# Altium schematic sheet Power_3.SchDoc
size A4; CompanyName: TH Nürnberg; Organization: UltraZohm; Address1: Kesslerplatz 12; Address2: 90489 Nürnberg; Address3: GERMANY; SheetNumber: 7; SheetTotal: 10
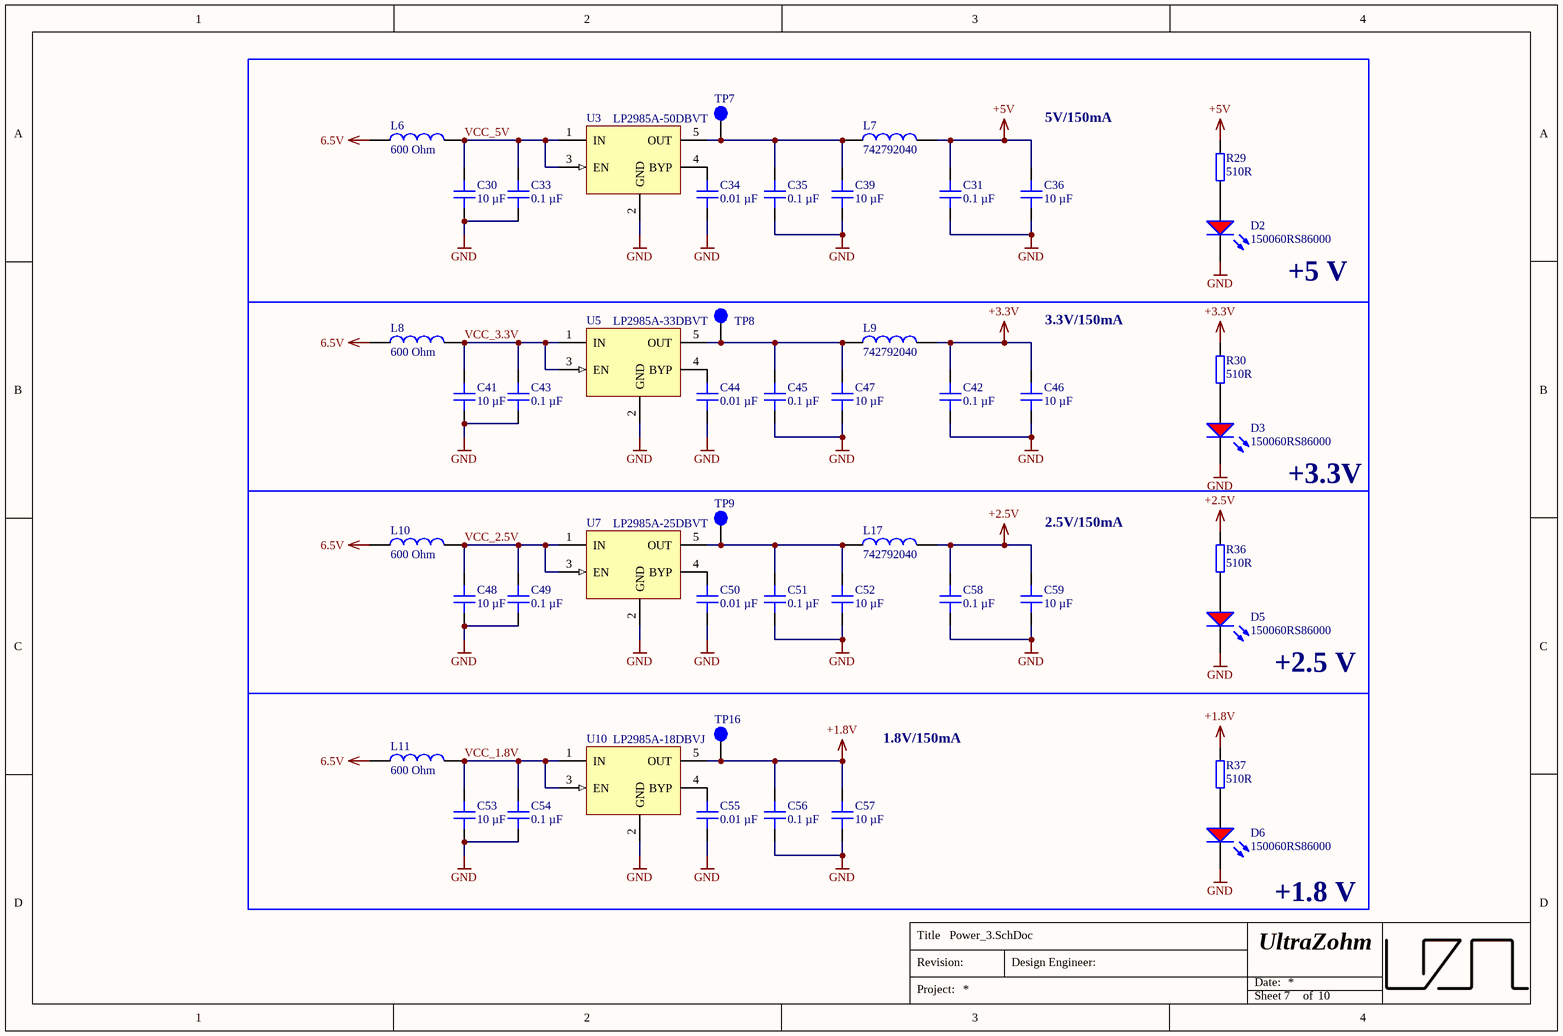
[diagram p0: Power_3.SchDoc]

## Parts
C30  10 µF  [C_1206]
C31  0.1 µF  [C_0603]
C33  0.1 µF  [C_0603]
C34  0.01 µF  [C_0603]
C35  0.1 µF  [C_0603]
C36  10 µF  [C_1206]
C39  10 µF  [C_1206]
C41  10 µF  [C_1206]
C42  0.1 µF  [C_0603]
C43  0.1 µF  [C_0603]
C44  0.01 µF  [C_0603]
C45  0.1 µF  [C_0603]
C46  10 µF  [C_1206]
C47  10 µF  [C_1206]
C48  10 µF  [C_1206]
C49  0.1 µF  [C_0603]
C50  0.01 µF  [C_0603]
C51  0.1 µF  [C_0603]
C52  10 µF  [C_1206]
C53  10 µF  [C_1206]
C54  0.1 µF  [C_0603]
C55  0.01 µF  [C_0603]
C56  0.1 µF  [C_0603]
C57  10 µF  [C_1206]
C58  0.1 µF  [C_0603]
C59  10 µF  [C_1206]
D2  150060RS86000  [WL-SMCW_0603]
D3  150060RS86000  [WL-SMCW_0603]
D5  150060RS86000  [WL-SMCW_0603]
D6  150060RS86000  [WL-SMCW_0603]
L6  600 Ohm  [WE-CBF_0805_High Current]
L7  742792040  [WE-CBF_0805_High Current]
L8  600 Ohm  [WE-CBF_0805_High Current]
L9  742792040  [WE-CBF_0805_High Current]
L10  600 Ohm  [WE-CBF_0805_High Current]
L11  600 Ohm  [WE-CBF_0805_High Current]
L17  742792040  [WE-CBF_0805_High Current]
R29  510R  [RES 0603_1608]
R30  510R  [RES 0603_1608]
R36  510R  [RES 0603_1608]
R37  510R  [RES 0603_1608]
TP7  -  [TP_1mm]  (value not drawn)
TP8  -  [TP_1mm]  (value not drawn)
TP9  -  [TP_1mm]  (value not drawn)
TP16  -  [TP_1mm]  (value not drawn)
U3  LP2985A-50DBVT  [SOT95P250X110-5N]
U5  LP2985A-33DBVT  [SOT95P250X110-5N]
U7  LP2985A-25DBVT  [SOT95P250X110-5N]
U10  LP2985A-18DBVJ  [SOT95P250X110-5N]

## Blocks framed on the sheet
+5 V: C30 C31 C33-C36 C39 D2 L6 L7 R29 TP7 U3

## Nets
6.5V: L6.1 L8.1 L10.1 L11.1
+1.8V: C56.2 C57.2 R37.2 TP16.1 U10.5(OUT)
+2.5V: C58.2 C59.2 L17.2 R36.2
+3.3V: C42.2 C46.2 L9.2 R30.2
+5V: C31.2 C36.2 L7.2 R29.2
GND: C30.1 C31.1 C33.1 C34.1 C35.1 C36.1 C39.1 C41.1 C42.1 C43.1 C44.1 C45.1 C46.1 C47.1 C48.1 C49.1 C50.1 C51.1 C52.1 C53.1 C54.1 C55.1 C56.1 C57.1 C58.1 C59.1 D2.1(K) D3.1(K) D5.1(K) D6.1(K) U3.2(GND) U5.2(GND) U7.2(GND) U10.2(GND)
VCC_1.8V: C53.2 C54.2 L11.2 U10.1(IN) U10.3(EN)
VCC_2.5V: C48.2 C49.2 L10.2 U7.1(IN) U7.3(EN)
VCC_3.3V: C41.2 C43.2 L8.2 U5.1(IN) U5.3(EN)
VCC_5V: C30.2 C33.2 L6.2 U3.1(IN) U3.3(EN)
NetC34_2: C34.2 U3.4(BYP)
NetC35_2: C35.2 C39.2 L7.1 TP7.1 U3.5(OUT)
NetC44_2: C44.2 U5.4(BYP)
NetC45_2: C45.2 C47.2 L9.1 TP8.1 U5.5(OUT)
NetC50_2: C50.2 U7.4(BYP)
NetC51_2: C51.2 C52.2 L17.1 TP9.1 U7.5(OUT)
NetC55_2: C55.2 U10.4(BYP)
NetD2_2: D2.2(A) R29.1
NetD3_2: D3.2(A) R30.1
NetD5_2: D5.2(A) R36.1
NetD6_2: D6.2(A) R37.1

## Notes on the sheet
- 5V/150mA
- 3.3V/150mA
- +3.3V
- 2.5V/150mA
- +2.5 V
- 1.8V/150mA
- +1.8 V
- Title
- Revision:
- Design Engineer:
- Date:
- Project:
- Sheet
- of

## Library data of the parts
C30 C36 C39 C41 C46-C48 C52 C53 C57 C59 = C1206C106J3RACAUTO: Capacitor 1206, 25 VDC, 10 µF, X7R; Manufacturer: KEMET; Tolerance: 5 %; Voltage Rating: 25 VDC; Created from: MGremer; Manufacturer Part Number: C1206C106J3RACAUTO; PartID: 24; Created On: 20.12.2020 13:54:13; ComponentLink1Description: Datasheet; ComponentLink1URL: https://www.mouser.de/datasheet/2/212/KEM_C1023_X7R_AUTO_SMD-1093309.pdf; Component Type: Capacitor 1206; Device Package: 1206; Last Updated: 20.12.2020 16:34:30; Mounting Type: SMD; Operating Temperature: -55 - 125°C; Series: SMD Auto X7R; Supplier 1: Mouser; Supplier Part Number 1: 80-C1206C106J3RAUTO; Type: Capacitor; Value: 10 µF; Live Cycle Status: 1; Stock number: Labor SMD Container
C31 C33 C35 C42 C43 C45 C49 C51 C54 C56 C58 = C0603X104K5RAC7411: Capacitor 0603, 50 VDC, 0.1 µF, X7R; Manufacturer: KEMET; Tolerance: 10 %; Voltage Rating: 50 VDC; Created from: MGremer; Manufacturer Part Number: C0603X104K5RAC7411; PartID: 3; Created On: 20.12.2020 13:54:13; ComponentLink1Description: Datasheet; ComponentLink1URL: https://www.mouser.de/datasheet/2/212/1/KEM_C1013_X7R_FT_CAP_SMD-1103280.pdf; Component Type: Capacitor 0603; Device Package: 0603; Last Updated: 04.03.2021 09:24:28; Mounting Type: SMD; Operating Temperature: -55 - 125°C; Series: SMD Comm X7R Flex; Supplier 1: Mouser; Supplier Part Number 1: 80-C0603X104K5R7411; Supplier 2: LCSC; Supplier Part Number 2: C14663; Type: Capacitor; Value: 0.1 µF; Live Cycle Status: 1; LCSC Part Number: C14663; Stock number: Labor SMD Container
C34 C44 C50 C55 = GCJ188R71H103KA01D: Capacitor 0603, 50 VDC, 0.01 µF, X7R; Manufacturer: muRata; Tolerance: 10 %; Voltage Rating: 50 VDC; Created from: MGremer; Manufacturer Part Number: GCJ188R71H103KA01D; PartID: 1; Created On: 20.12.2020 13:54:13; ComponentLink1Description: Datasheet; ComponentLink1URL: https://www.mouser.de/datasheet/2/281/c03e-516224.pdf; Component Type: Capacitor 0603; Device Package: 0603; Last Updated: 20.12.2020 16:24:16; Mounting Type: SMD; Operating Temperature: -55 - 125°C; Series: GCJ; Supplier 1: Mouser; Supplier Part Number 1: 81-GCJ188R71H103KA1D; Type: Capacitor; Value: 0.01 µF; Live Cycle Status: 1; Stock number: Labor SMD Container
D2 D3 D5 D6 = 150060RS86000: WL-SMCW SMD Mono-color Chip LED Waterclear Red; Manufacturer: Wuerth Elektronik; Type: Standard; Created from: MGremer; Forward Current I_f: 20 mA; Forward Voltage U_f: 2 V; Wavelength: 624 nm; Light Intensity: 800 mcd; Nominal Power: 48 mW; Manufacturer Part Number: 150060RS86000; PartID: 3; Created On: 08.12.2020 10:48:12; ComponentLink1Description: Datasheet; ComponentLink1URL: https://www.mouser.de/datasheet/2/445/150120RS75000-1714636.pdf; Component Type: LED Diode; Device Package: 0603; Last Updated: 03.03.2021 09:59:52; Mounting Type: SMD; Operating Temperature: -40 - 85 °C; Supplier 1: Mouser; Supplier Part Number 1: 710-150060RS86000; Supplier 2: Farnell; Supplier Part Number 2: 3408608; Supplier 3: Digi-Key; Supplier Part Number 3: 732-150060RS86000CT-ND; Live Cycle Status: 1; Stock number: not stored; Color: red
L6 L8 L10 L11 = 742792040: Inductance, 0805, 100 MHz, 600 Ohm, 2 A; Manufacturer: Wurth Elektronik; Type: Inductance SMD; DC current: 2 A; Created from: MGremer; Manufacturer Part Number: 742792040; PartID: 1; Created On: 18.01.2021 14:53:17; ComponentLink1Description: Datasheet; ComponentLink1URL: https://www.mouser.de/datasheet/2/445/742792040-1720361.pdf; Component Type: Inductance; Device Package: 0805; Last Updated: 18.01.2021 14:53:25; Mounting Type: SMD; Operating Temperature: -55 - 125 °C; Series: WE-CBF; Supplier 1: Mouser; Supplier Part Number 1: 710-742792040; Value: 600 Ohm; Live Cycle Status: 1; Stock number: not stored
L7 L9 L17 = 742792040: Inductance, 0805, 100 MHz, 600 Ohm, 2 A; Manufacturer: Wurth Elektronik; Type: Inductance SMD; DC current: 2 A; Value: 600 Ohm; Created from: MGremer; Manufacturer Part Number: 742792040; PartID: 1; Created On: 18.01.2021 14:53:17; ComponentLink1Description: Datasheet; ComponentLink1URL: https://www.mouser.de/datasheet/2/445/742792040-1720361.pdf; Component Type: Inductance; Device Package: 0805; Last Updated: 18.01.2021 14:53:25; Mounting Type: SMD; Operating Temperature: -55 - 125 °C; Series: WE-CBF; Supplier 1: Mouser; Supplier Part Number 1: 710-742792040; Live Cycle Status: 1; Stock number: not stored
R29 R30 R36 R37 = RK73B1JTTD511J: SMD resistor E24 series; Manufacturer: KOA Speer; Tolerance: 5%; Created from: MGremer; Manufacturer Part Number: RK73B1JTTD511J; PartID: 67; Created On: 14.12.2020 16:17:14; ComponentLink1Description: Datasheet; ComponentLink1URL: https://www.mouser.de/datasheet/2/219/RK73B-1825463.pdf; Component Type: SMD resistor; Device Package: 0603; Last Updated: 02.03.2021 14:07:32; Mounting Type: SMD; Supplier 1: Mouser; Supplier Part Number 1: 660-RK73B1JTTD511J; Type: Resistor; Value: 510R; Live Cycle Status: 1; Stock number: Labor SMD Container
TP7-TP9 TP16 = -: Test Point 1 mm; Value: TP; Created from: MGremer; Created: 2018_06_25_AGeiger; Manufacturer Part Number: -; PartID: 9; Created On: 02.03.2021 14:59:37; ComponentLink1Description: Datasheet; ComponentLink1URL: -; ComponentLink2Description: Homepage; ComponentLink2URL: -; Component Type: Test Point; Device Package: SMD; Last Updated: 08.10.2021 21:16:06; Manufacturer: -; Minimum Order: 1; Mounting Type: SMD; Supplier 1: -; Supplier Part Number 1: -; Type: Test point; Live Cycle Status: 1; Stock number: not stored
U3 = LP2985A-50DBVT: 150 mA Low-noise Low-dropout regulator with shutdown; fixed 5 V output; MPN: LP2985A-25; MF: Texas Instruments; Value: 5 V; Created from: MGremer; Supplier 1: Mouser; Supplier Part Number 1: 595-LP2985A-50DBVT; Package: SOT-23-5; ComponentLink1Description: Datasheet; ComponentLink1URL: https://www.ti.com/lit/ds/symlink/lp2985a.pdf?HQS=dis-mous-null-mousermode-dsf-pf-null-wwe&ts=1629794945152; ComponentLink2Description: Datasheet; ComponentLink2URL: https://www.ti.com/lit/ds/symlink/lp2985a.pdf; Manufacturer Part Number: LP2985A-50DBVT; PartID: 4; Created On: 24.08.2021 11:34:06; Component Type: LDO; Device Package: SMD; Last Updated: 24.08.2021 11:44:26; Manufacturer: Texas Instruments; Mounting Type: SMD; Operating Temperature: -40 - 125 °C; Series: LP2985A-50; Type: LDO; Live Cycle Status: 1; Stock number: not stored
U5 = LP2985A-33DBVT: 150 mA Low-noise Low-dropout regulator with shutdown; fixed 3.3 V output; MPN: LP2985A-25; MF: Texas Instruments; Value: 3.3 V; Created from: MGremer; Supplier 1: Mouser; Supplier Part Number 1: 595-LP2985A-33DBVT; Package: SOT-23-5; ComponentLink1Description: Datasheet; ComponentLink1URL: https://www.ti.com/lit/ds/symlink/lp2985a.pdf?HQS=dis-mous-null-mousermode-dsf-pf-null-wwe&ts=1629794945152; ComponentLink2Description: Datasheet; ComponentLink2URL: https://www.ti.com/lit/ds/symlink/lp2985a.pdf; Manufacturer Part Number: LP2985A-33DBVT; PartID: 3; Created On: 24.08.2021 11:34:06; Component Type: LDO; Device Package: SMD; Last Updated: 24.08.2021 11:39:57; Manufacturer: Texas Instruments; Mounting Type: SMD; Operating Temperature: -40 - 125 °C; Series: LP2985A-25; Type: LDO; Live Cycle Status: 1; Stock number: not stored
U7 = LP2985A-25DBVT: 150 mA Low-noise Low-dropout regulator with shutdown; fixed 2.5 V output; MF: Texas Instruments; Value: 2.5 V; Created from: MGremer; MPN: LP2985A-25; Supplier 1: Mouser; Supplier Part Number 1: 595-LP2985A-25DBVT; Package: SOT-23-5; ComponentLink1Description: Datasheet; ComponentLink1URL: https://www.ti.com/lit/ds/symlink/lp2985a.pdf?HQS=dis-mous-null-mousermode-dsf-pf-null-wwe&ts=1629794945152; ComponentLink2Description: Datasheet; ComponentLink2URL: https://www.ti.com/lit/ds/symlink/lp2985a.pdf; Manufacturer Part Number: LP2985A-25DBVT; PartID: 2; Created On: 24.08.2021 11:34:06; Component Type: LDO; Device Package: SMD; Last Updated: 24.08.2021 11:39:57; Manufacturer: Texas Instruments; Mounting Type: SMD; Operating Temperature: -40 - 125 °C; Series: LP2985A-25; Type: LDO; Live Cycle Status: 1; Stock number: not stored
U10 = LP2985A-18DBVJ: 150 mA Low-noise Low-dropout regulator with shutdown; Manufacturer 1: Texas Instruments; Created from: MGremer; Supplier 1: Mouser; Supplier Part Number 1: 595-LP2985A-18DBVJ; Package: SOT-23-5; ComponentLink1Description: Datasheet; ComponentLink1URL: https://www.ti.com/general/docs/suppproductinfo.tsp?distId=26&gotoUrl=http%3A%2F%2Fwww.ti.com%2Flit%2Fgpn%2Flp2985a; ComponentLink2Description: Datasheet; ComponentLink2URL: https://www.ti.com/lit/ds/symlink/lp2985a.pdf; Manufacturer Part Number 1: LP2985A-18; Manufacturer Part Number: LP2985A-18DBVJ; PartID: 1; Created On: 24.08.2021 11:34:06; Component Type: LDO; Device Package: SMD; Last Updated: 24.08.2021 11:34:06; Manufacturer: Texas Instruments; Mounting Type: SMD; Operating Temperature: -40 - 125 °C; Series: LP2985A-18; Type: LDO; Live Cycle Status: 1; Stock number: not stored